# Altium schematic sheet SAMC21_Xplained_Pro_Level_Shifters.SchDoc: Arduino Uno interface connectors
size A3; Organization: ATMEL Norway; Address1: Vestre Rosten 79; Address2: N-7075 TILLER; Address3: NORWAY; DocumentNumber: A09-2419; Revision: 1; SheetNumber: 7; SheetTotal: 7; PageSetup: Record=PageOptions|CenterHorizontal=True|CenterVertical=True|PrintScale=1.01|XCorrection=1.00|YCorrection=1.00|PrintKind=1|BorderSize=5000000|LeftOffset=0|BottomOffset=0|Orientation=2|PaperLength=1000|PaperWidth=1000|Scale=100|PaperSource=7|PrintQuality=-4|MediaType=1|DitherType=10|PaperKind=A3 (297 x 420 mm)|PrintScaleMode=1
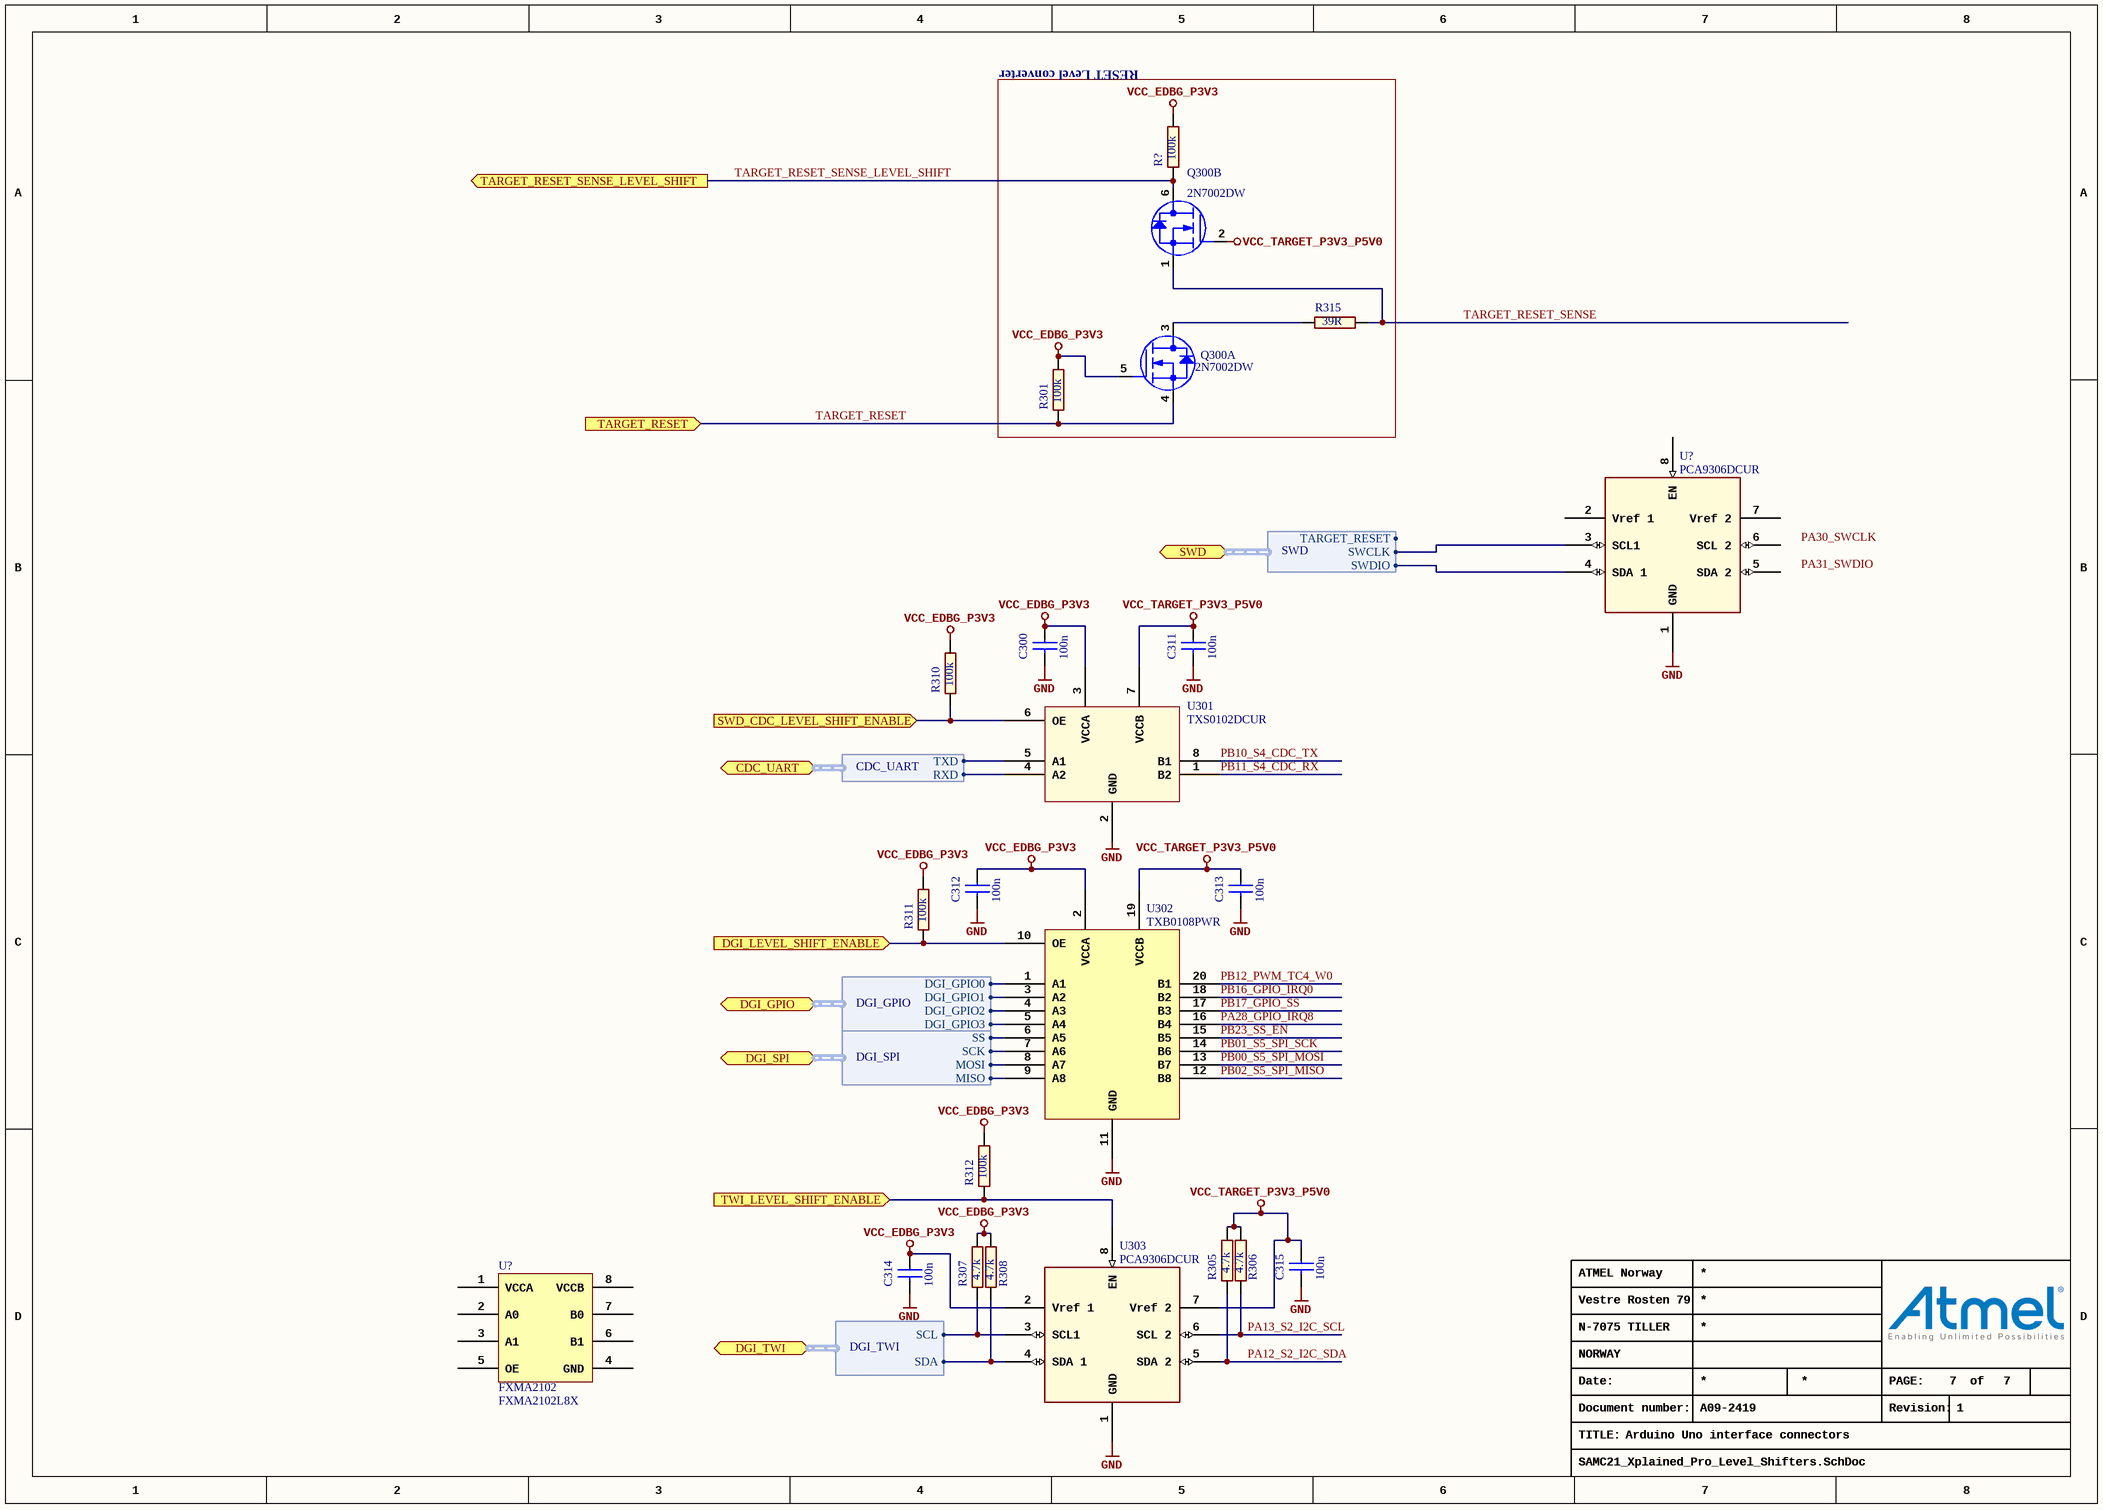
[diagram p0: SAMC21_Xplained_Pro_Level_Shifters.SchDoc]

## Parts
(Parts that share a designator on the sheet are numbered #1, #2 ... from top to bottom, then left to right.)
C300  value 100n  [AP1-00001]  (hidden comment: CAP-NONPOL)
C311  value 100n  [AP1-00001]  (hidden comment: CAP-NONPOL)
C312  value 100n  [AP1-00001]  (hidden comment: CAP-NONPOL)
C313  value 100n  [AP1-00001]  (hidden comment: CAP-NONPOL)
C314  value 100n  [AP1-00001]  (hidden comment: CAP-NONPOL)
C315  value 100n  [AP1-00001]  (hidden comment: CAP-NONPOL)
Q300  value 2N7002DW  [AP5-00001]  (hidden comment: Same as 2N7002 but with two MOSFETs in one package)  (parts A,B of 2)
R301  value 100k  [AP2-00000]  (hidden comment: R2)
R305  value 4.7k  [AP2-00000]  (hidden comment: R2)
R306  value 4.7k  [AP2-00000]  (hidden comment: R2)
R307  value 4.7k  [AP2-00000]  (hidden comment: R2)
R308  value 4.7k  [AP2-00000]  (hidden comment: R2)
R310  value 100k  [AP2-00000]  (hidden comment: R2)
R311  value 100k  [AP2-00000]  (hidden comment: R2)
R312  value 100k  [AP2-00000]  (hidden comment: R2)
R315  value 39R  [AP2-00011]  (hidden comment: R2)
R?  value 100k  [AP2-00000]  (hidden comment: R2)
U301  TXS0102DCUR  [AP0-00155]
U302  TXB0108PWR  [AP6-00006]
U303  value PCA9306DCUR  [AP6-00102]
U?#1  value PCA9306DCUR  [AP6-00102]
U?#2  FXMA2102  value FXMA2102L8X  [AP6-00258]

## Blocks framed on the sheet
RESET Level converter: Q300 R301 R315 R?

## Ports
CDC_UART (harness CDC_UART), DGI_GPIO (harness DGI_GPIO), DGI_LEVEL_SHIFT_ENABLE (in), DGI_SPI (harness DGI_SPI), DGI_TWI (harness DGI_TWI), SWD (harness SWD), SWD_CDC_LEVEL_SHIFT_ENABLE (in), TARGET_RESET (in), TARGET_RESET_SENSE_LEVEL_SHIFT (out), TWI_LEVEL_SHIFT_ENABLE (in)

## Harnesses
SWD: SWCLK, SWDIO, TARGET_RESET
DGI_GPIO: DGI_GPIO0, DGI_GPIO1, DGI_GPIO2, DGI_GPIO3
DGI_SPI: MISO, MOSI, SCK, SS
DGI_TWI: SCL, SDA
CDC_UART: RXD, TXD

## Nets
GND: C300.2 C311.2 C312.2 C313.2 C314.2 C315.2 U302.11(GND) U303.1(GND) U?#1.1(GND)
VCC_EDBG_P3V3: C300.1 C312.1 C314.1 Q300.5(G1) R301.2 R307.2 R308.2 R310.2 R311.2 R312.2 R?.2 U301.3(VCCA) U302.2(VCCA) U303.2(Vref_1)
VCC_TARGET_P3V3_P5V0: C311.1 C313.1 C315.1 Q300.2(G2) R305.2 R306.2 U301.7(VCCB) U302.19(VCCB) U303.7(Vref_2)
DGI_LEVEL_SHIFT_ENABLE: R311.1 U302.10(OE) ; port DGI_LEVEL_SHIFT_ENABLE
PA12_S2_I2C_SDA: R305.1 U303.5(SDA_2)
PA13_S2_I2C_SCL: R306.1 U303.6(SCL_2)
PA28_GPIO_IRQ8: U302.16(B4)
PB00_S5_SPI_MOSI: U302.13(B7)
PB01_S5_SPI_SCK: U302.14(B6)
PB02_S5_SPI_MISO: U302.12(B8)
PB10_S4_CDC_TX: U301.8(B1)
PB11_S4_CDC_RX: U301.1(B2)
PB12_PWM_TC4_W0: U302.20(B1)
PB16_GPIO_IRQ0: U302.18(B2)
PB17_GPIO_SS: U302.17(B3)
PB23_SS_EN: U302.15(B5)
SWD_CDC_LEVEL_SHIFT_ENABLE: R310.1 U301.6(OE) ; port SWD_CDC_LEVEL_SHIFT_ENABLE
TARGET_RESET: Q300.4(S1) R301.1 ; port TARGET_RESET
TARGET_RESET_SENSE: Q300.1(S2) R315.2
TARGET_RESET_SENSE_LEVEL_SHIFT: Q300.6(D2) R?.1 ; port TARGET_RESET_SENSE_LEVEL_SHIFT
TWI_LEVEL_SHIFT_ENABLE: R312.1 U303.8(EN) ; port TWI_LEVEL_SHIFT_ENABLE
NetQ300_3: Q300.3(D1) R315.1
NetR307_1: R307.1 U303.3(SCL1) ; port DGI_TWI.SCL
NetR308_1: R308.1 U303.4(SDA_1) ; port DGI_TWI.SDA
NetU301_4: U301.4(A2) ; port CDC_UART.RXD
NetU301_5: U301.5(A1) ; port CDC_UART.TXD
NetU302_1: U302.1(A1) ; port DGI_GPIO.DGI_GPIO0
NetU302_3: U302.3(A2) ; port DGI_GPIO.DGI_GPIO1
NetU302_4: U302.4(A3) ; port DGI_GPIO.DGI_GPIO2
NetU302_5: U302.5(A4) ; port DGI_GPIO.DGI_GPIO3
NetU302_6: U302.6(A5) ; port DGI_SPI.SS
NetU302_7: U302.7(A6) ; port DGI_SPI.SCK
NetU302_8: U302.8(A7) ; port DGI_SPI.MOSI
NetU302_9: U302.9(A8) ; port DGI_SPI.MISO
NetU?#1_3: U?#1.3(SCL1) ; port SWD.SWCLK
NetU?#1_4: U?#1.4(SDA_1) ; port SWD.SWDIO

Not connected (* = marked no-connect by the designer): U301 2(GND); U?#1 2(Vref_1) 5(SDA_2) 6(SCL_2) 7(Vref_2) 8(EN); U?#2 1(VCCA) 2(A0) 3(A1) 4(GND) 5(OE) 6(B1) 7(B0) 8(VCCB)

## Notes on the sheet
- Date:
- PAGE:
- of
- TITLE:
- Document number:
- Revision:
- Labels drawn without touching a wire or pin: GND, PA30_SWCLK, PA31_SWDIO

## Library data of the parts
C300 C311-C315 = A01-0246: Ceramic capacitor, SMD 0402, X7R, 16V, +/-10%; PartGroup: Capacitors,Ceramic,SMD 0402; Manufacturer: Kemet; MPN: C0402C104K4RACTU; TemperatureRange: -55 - +125 deg C; ComponentStatus: 'Active (verified)'; Status: Active; Verified by: Lars Helge Mo; Verified date: 2005-12-15; AN: A01-0246; Tolerance: 16V, +/-10%; Height: 0,5; FootprintStatus: 'Active (Verified)'
Q300 = A05-0051: Dual N-Channel MOSFET, 60V, 115mA cont,RDS(ON) < 7.5 Ohm @50mA@5V, SOT-363; PartGroup: Transistors,Small signal FET,SMD; Manufacturer: Fairchild; TemperatureRange: -65 to 150 deg C; ComponentStatus: 'Active (verified)'; Status: New; AN: A05-0051; Height: 1,10000002384186; MPN: 2N7002DW; FootprintStatus: 'Active (Verified)'
R301 R310-R312 R? = A02-0260: Thick film resistor, SMD 0402, 1/16W, 1%; PartGroup: Resistors,SMD,0402 1%; TemperatureRange: -55 - +125 deg C; ComponentStatus: 'Active (verified)'; Status: Active; Verified by: Lars Helge Mo; Verified date: 2005-12-19; AN: A02-0260; Tolerance: 1 %; Height: 0,349999994039536; FootprintStatus: 'Active (Verified)'
R305-R308 = A02-0228: Thick film resistor, SMD 0402, 1/16W, 1%; PartGroup: Resistors,SMD,0402 1%; TemperatureRange: -55 - +125 deg C; ComponentStatus: 'Active (verified)'; Status: Active; Verified by: Lars Helge Mo; Verified date: 2005-12-19; AN: A02-0228; Tolerance: 1 %; Height: 0.349999994039536; FootprintStatus: 'Active (Verified)'
R315 = A02-0178: Thick film resistor, SMD 0402, 1/16W, 1%; PartGroup: Resistors,SMD,0402 1%; TemperatureRange: -55 - +125 deg C; ComponentStatus: 'Active (verified)'; Status: Active; Verified by: Lars Helge Mo; Verified date: 2005-12-19; AN: A02-0178; Tolerance: 1 %; Height: 0,349999994039536; FootprintStatus: 'Active (Verified)'
U301 = A06-0851: 2-BIT BIDIRECTIONAL VOLTAGE-LEVEL TRANSLATOR 8PSOP; PartGroup: Integrated Circuits,Interface ICs,Level translators; Manufacturer: Texas Instruments; ComponentStatus: 'New (not verified)'; Value: TXS0102DCUR; AN: A06-0851; MPN: TXS0102DCUR; FootprintStatus: 'New (Not verified)'
U302 = A06-1120: 8-BIT BIDIRECTIONAL VOLTAGE-LEVEL TRANSLATOR 20TSSOP; PartGroup: Integrated Circuits,Interface ICs,Level translators; Manufacturer: Texas Instruments; TemperatureRange: -40C to +85C; ComponentStatus: 'Active (verified)'; AN: A06-1120; Value: TXB0108PWR; Height: 1.20000004768372; MPN: TXB0108PWR; FootprintStatus: 'Active (Verified)'
U303 U?#1 = A06-0625: Bi Directional I2C and SM Bus; PartGroup: Integrated Circuits,Interface ICs,I2C; Manufacturer: Texas Instruments; TemperatureRange: -40C to 85C; ComponentStatus: 'Active (verified)'; Status: New; AN: A06-0625; Height: 0.899999976158142; MPN: PCA9306DCUR; FootprintStatus: 'Active (Verified)'
U?#2 = A06-0714: Dual supply, 2-bit, voltage translator, buffer, repeater, isolator for I2C applications; PartGroup: Integrated Circuits,Interface ICs,I2C; Manufacturer: Fairchild; TemperatureRange: -40 - +85 deg C; ComponentStatus: 'Active (verified)'; AN: A06-0714; Height: 0.550000011920929; MPN: FXMA2102L8X; FootprintStatus: 'Active (Verified)'